# EAGLE design simple-loop-active5 (EAGLE 6.6.0)

## Sheet 1 of 2
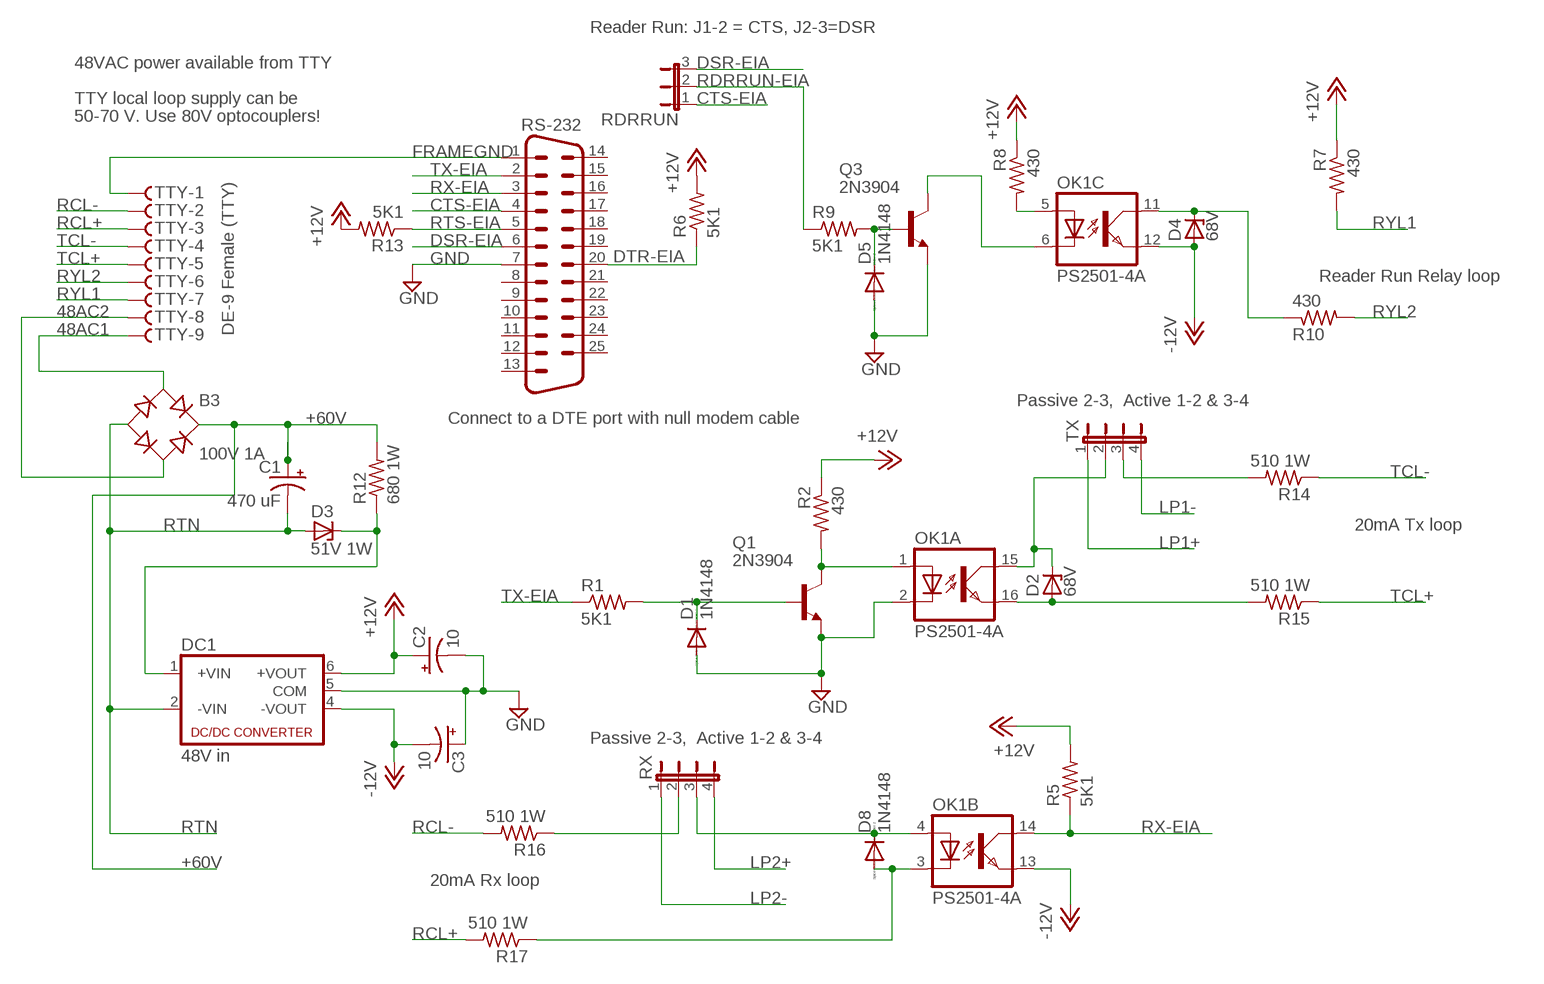
[diagram p0: schematic, sheet 1]

### Parts
B3  100V 1A  RB1A  [RB1A]
C1  470 uF  CPOL-USE7.5-18  [E7,5-18]
C2  10  CPOL-USB45181A  [B45181A]
C3  10  CPOL-USB45181A  [B45181A]
D1  1N4148  1N4148DO35-10  [DO35-10]
D2  68V  ZENER-DIODEDO41Z10  [DO41Z10]
D3  51V 1W  ZENER-DIODEDO41Z10  [DO41Z10]
D4  68V  ZENER-DIODEDO41Z10  [DO41Z10]
D5  1N4148  1N4148DO35-10  [DO35-10]
D8  1N4148  1N4148DO35-10  [DO35-10]
DC1  48V in  NMA  [NMA]
OK1  PS2501-4A  ILQ1  [DIL16]
Q1  2N3904  [TO92]
Q3  2N3904  [TO92]
R1  5K1  R-US_0207/10  [0207/10]
R2  430  R-US_0207/10  [0207/10]
R5  5K1  R-US_0207/10  [0207/10]
R6  5K1  R-US_0207/10  [0207/10]
R7  430  R-US_0207/10  [0207/10]
R8  430  R-US_0207/10  [0207/10]
R9  5K1  R-US_0207/10  [0207/10]
R10  430  R-US_0207/10  [0207/10]
R12  680 1W  R-US_0817/7V  [P0817V]
R13  5K1  R-US_0207/10  [0207/10]
R14  510 1W  R-US_0817/7V  [P0817V]
R15  510 1W  R-US_0817/7V  [P0817V]
R16  510 1W  R-US_0817/7V  [P0817V]
R17  510 1W  R-US_0817/7V  [P0817V]
RDRRUN  JP2E  [JP2]
RS-232  M25H  [M25H]
RX  JP4E  [JP4]
TTY  F09HS  [F09H]
TX  JP4E  [JP4]

### Nets
48AC1: B3.AC1 TTY.9
48AC2: B3.AC2 TTY.8
+12V: C2.+ DC1.6(+VOUT) R2.1 R5.2 R6.2 R7.1 R8.1 R13.2
+48VDC: D3.C DC1.1(+VIN) R12.1
+60V: B3.+ C1.+ R12.2 ; also sheet 2
-12V: C3.- D4.A DC1.4(-VOUT) OK1.12(C:EMIT) OK1.13(B:EMIT)
CTS-EIA: RDRRUN.1 RS-232.4
DSR-EIA: RDRRUN.3 RS-232.6
DTR-EIA: R6.1 RS-232.20
FRAMEGND: RS-232.1 TTY.1
GND [GND]: C2.- C3.+ D1.A D5.A DC1.5(COM) OK1.2(A:C) Q1.3(E) Q3.3(E) RS-232.7
LP1+: TX.1 ; also sheet 2
LP1-: TX.4 ; also sheet 2
LP2+: RX.4 ; also sheet 2
LP2-: RX.1 ; also sheet 2
N$1: D8.C OK1.4(B:A) RX.3
N$2: R16.1 RX.2
N$3: D8.A OK1.3(B:C) R17.1
N$4: D2.A OK1.16(A:EMIT) R15.2
N$5: OK1.5(C:A) R8.2
N$6: D2.C OK1.15(A:COL) TX.2
N$7: D1.C Q1.2(B) R1.2
N$8: D4.C OK1.11(C:COL) R10.1
N$9: OK1.1(A:A) Q1.1(C) R2.2
N$15: OK1.6(C:C) Q3.1(C)
N$16: D5.C Q3.2(B) R9.2
N$19: R14.2 TX.3
RCL+: R17.2 TTY.3
RCL-: R16.2 TTY.2
RDRRUN-EIA: R9.1 RDRRUN.2
RTN: B3.- C1.- D3.A DC1.2(-VIN) ; also sheet 2
RTS-EIA: R13.1 RS-232.5
RX-EIA: OK1.14(B:COL) R5.1 RS-232.3
RYL1: R7.2 TTY.7
RYL2: R10.2 TTY.6
TCL+: R15.1 TTY.5
TCL-: R14.1 TTY.4
TX-EIA: R1.1 RS-232.2
Unconnected: RS-232.8 RS-232.9 RS-232.10 RS-232.11 RS-232.12 RS-232.13 RS-232.14 RS-232.15 RS-232.16 RS-232.17 RS-232.18 RS-232.19 RS-232.21 RS-232.22 RS-232.23 RS-232.24 RS-232.25

### Notes on the sheet
- Reader Run: J1-2 = CTS, J2-3=DSR
- 48VAC power available from TTY
- TTY local loop supply can be
- 50-70 V. Use 80V optocouplers!
- Reader Run Relay loop
- DE-9 Female (TTY)
- Passive 2-3,  Active 1-2 & 3-4
- Connect to a DTE port with null modem cable
- 20mA Tx loop
- Passive 2-3,  Active 1-2 & 3-4
- 20mA Rx loop

## Sheet 2 of 2
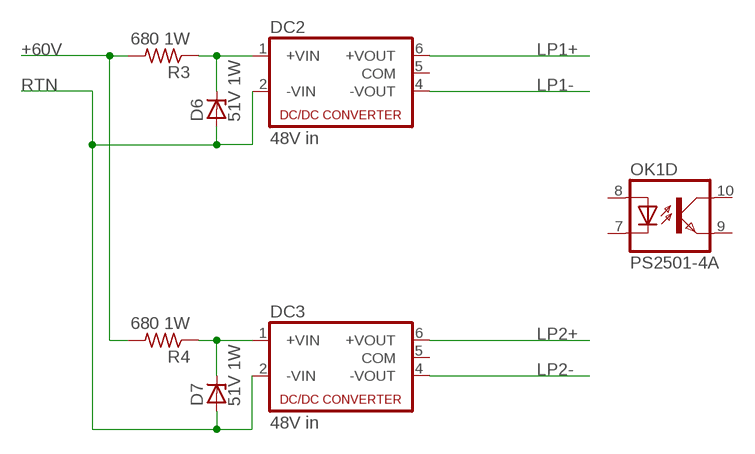
[diagram p1: schematic, sheet 2]

### Parts
D6  51V 1W  ZENER-DIODEDO41Z10  [DO41Z10]
D7  51V 1W  ZENER-DIODEDO41Z10  [DO41Z10]
DC2  48V in  NMA  [NMA]
DC3  48V in  NMA  [NMA]
R3  680 1W  R-US_0817/7V  [P0817V]
R4  680 1W  R-US_0817/7V  [P0817V]

### Nets
+48VDC1: D6.C DC2.1(+VIN) R3.1
+48VDC2: D7.C DC3.1(+VIN) R4.1
+60V: R3.2 R4.2 ; also sheet 1
LP1+: DC2.6(+VOUT) ; also sheet 1
LP1-: DC2.4(-VOUT) ; also sheet 1
LP2+: DC3.6(+VOUT) ; also sheet 1
LP2-: DC3.4(-VOUT) ; also sheet 1
RTN: D6.A D7.A DC2.2(-VIN) DC3.2(-VIN) ; also sheet 1
Unconnected: DC2.5(COM) DC3.5(COM) OK1.7(D:C) OK1.8(D:A) OK1.9(D:EMIT) OK1.10(D:COL)

## Library data of the parts
B3 = rectifier:RB1A: RECTIFIER 1 A
C1-C3 = rcl:CPOL-US: POLARIZED CAPACITOR, American symbol
D1 D5 D8 = diode:1N4148: DIODE high speed (Philips)
D2-D4 D6 D7 = diode:ZENER-DIODE: Z-Diode
DC1-DC3 = dc-dc-converter:NMA: DC-DC CONVERTER; MF: C & D TECHNOLOGIES, INC; MPN: NMA0515SC; OC_FARNELL: 1021434; OC_NEWARK: 61K3064
OK1 = optocoupler:ILQ1: SIEMENS OPTO COUPLER; MF: VISHAY/TELEFUNKEN; MPN: ILQ1; OC_FARNELL: 1469501; OC_NEWARK: 88K1954
Q1 Q3 = transistor-npn:2N3904: NPN Transistor
R1-R10 R12-R17 = rcl:R-US_: RESISTOR, American symbol
RDRRUN = jumper:JP2E: JUMPER
RS-232 = con-subd:M25: SUB-D; OC_FARNELL: unknown; OC_NEWARK: unknown
RX TX = jumper:JP4E: JUMPER
TTY = con-subd:F09?S: SUB-D; OC_FARNELL: unknown; OC_NEWARK: unknown

## Net classes
1 GND: width 0.508 mm

## Board
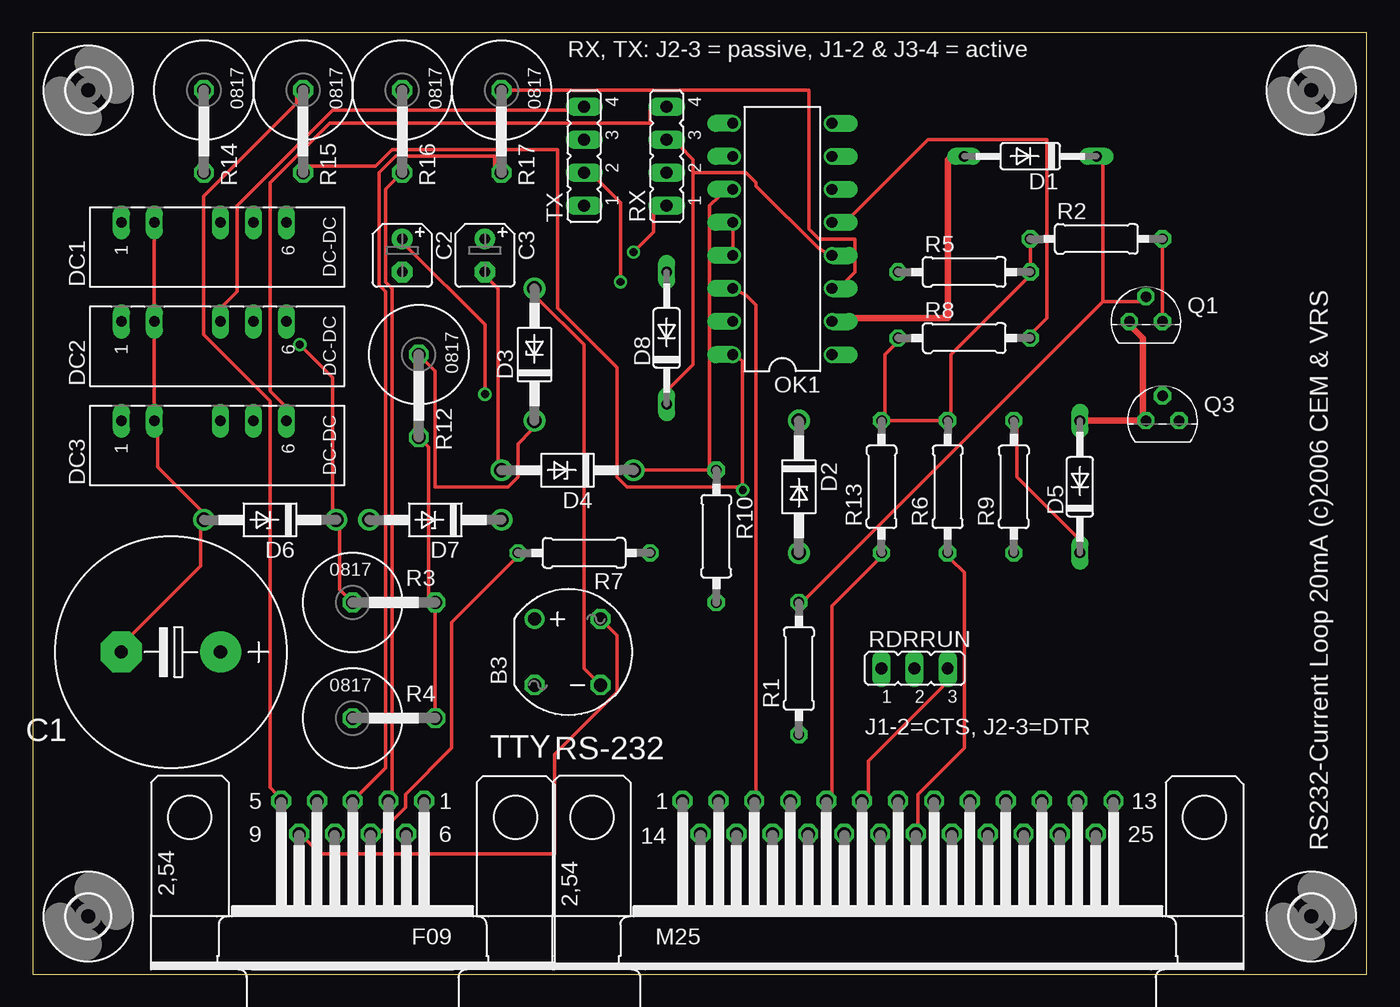
[diagram p2: board, top side]
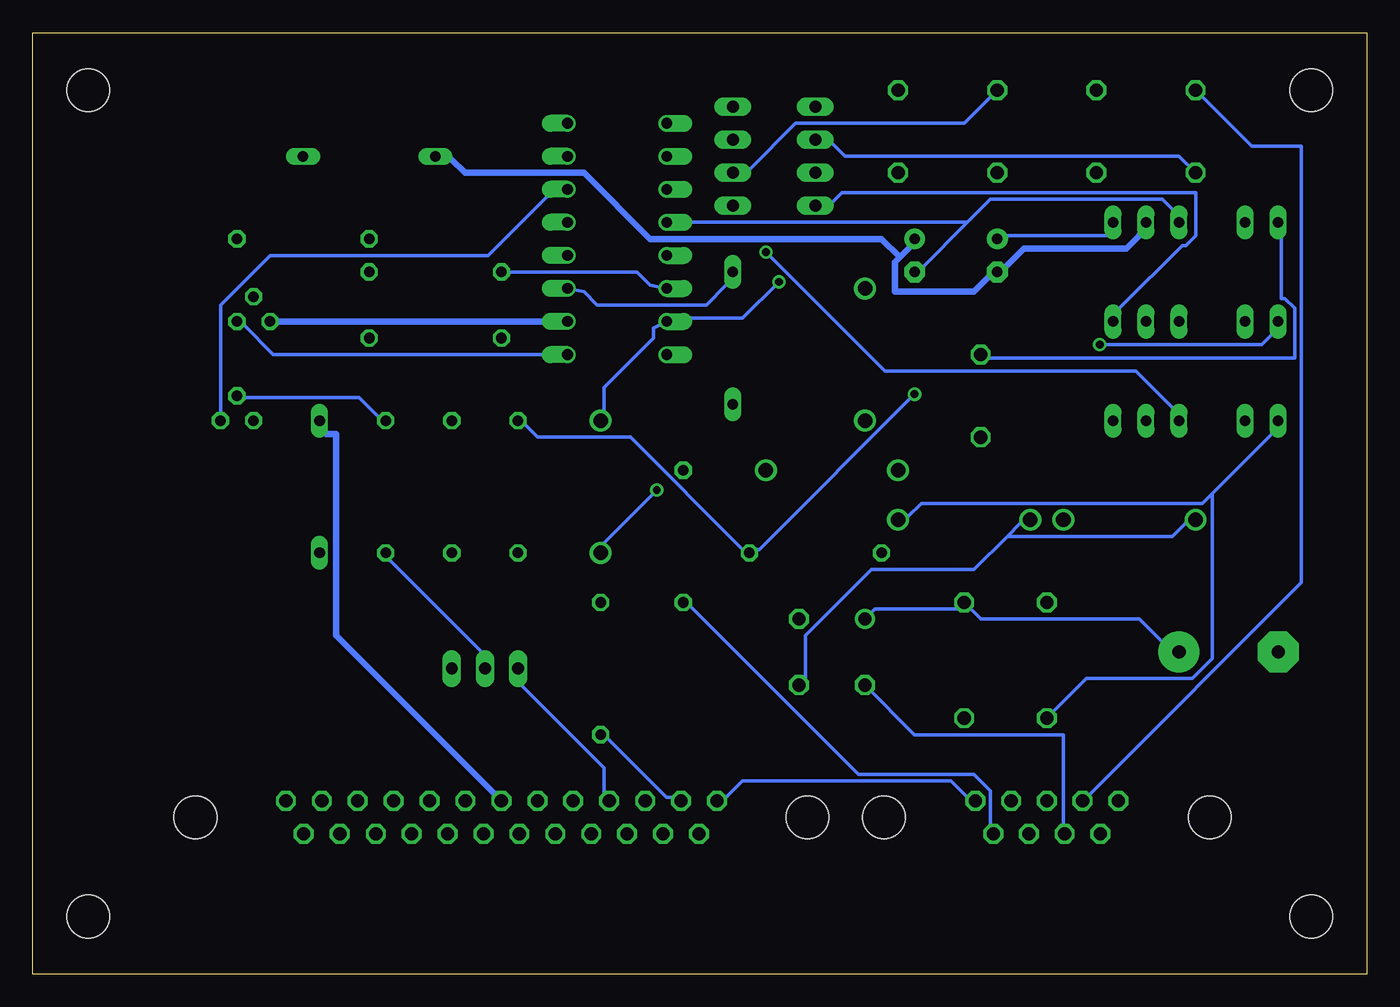
[diagram p3: board, bottom side, seen from below]

Size 102.54 x 72.37 mm. Coordinates in mm from the lower left corner, seen from the top.
Outline: 102.54,0 102.54,72.37 0,72.37 0,0 102.54,0
Copper layers (1*16): Top 0.035mm / dielectric 1.5mm / Bottom 0.035mm
Design rules "10mils *": minimum track width 10mil, minimum drill 24mil, track to track 10mil, track to pad 10mil, pad to pad 10mil, via to via 10mil, smd to smd 10mil, copper to edge 40mil, drill to drill 10mil, minimum pad ring 10mil, minimum via ring 8mil, stop-mask expansion 0mil, vias tented up to drill 0mil, thermal gap 10mil

### Footprints (pad centres in the part's own frame; a part is rotated, then mirrored left to right if it is on the bottom)
RB1A = drill 1.016: + -2.54,2.54 | drill 1.016 octagon: - 2.54,-2.54; AC1 2.54,2.54; AC2 -2.54,-2.54
E7,5-18 = drill 1.016 pad 3.15: + -3.81,0 | drill 1.016 pad 3.15 octagon: - 3.81,0
B45181A = drill 0.813 pad 1.6: + -1.27,0 | drill 0.813 pad 1.6 octagon: - 1.27,0
DO35-10 = drill 0.813 long: A 5.08,0; C -5.08,0
DO41Z10 = drill 1.118: A 5.08,0; C -5.08,0
NMA = drill 0.813 long: 1 0,6.35; 2 0,3.81; 4 0,-1.27; 5 0,-3.81; 6 0,-6.35
DIL16 = drill 0.813 offset: 1 -8.89,-3.81; 2 -6.35,-3.81; 3 -3.81,-3.81; 4 -1.27,-3.81; 5 1.27,-3.81; 6 3.81,-3.81; 7 6.35,-3.81; 8 8.89,-3.81; 9 8.89,3.81; 10 6.35,3.81; 11 3.81,3.81; 12 1.27,3.81; 13 -1.27,3.81; 14 -3.81,3.81; 15 -6.35,3.81; 16 -8.89,3.81
TO92 = drill 0.813 octagon: 1 1.27,0; 2 0,1.905; 3 -1.27,0
0207/10 = drill 0.813 octagon: 1 -5.08,0; 2 5.08,0
P0817V = drill 1.016 octagon: 1 -5.08,0; 2 1.27,0
JP2 = drill 0.914 long: 1 -2.54,0; 2 0,0; 3 2.54,0
M25H = drill 1.016 octagon: 1 -16.561,1.27; 2 -13.792,1.27; 3 -11.049,1.27; 4 -8.28,1.27; 5 -5.512,1.27; 6 -2.769,1.27; 7 0,1.27; 8 2.769,1.27; 9 5.512,1.27; 10 8.28,1.27; 11 11.049,1.27; 12 13.792,1.27; 13 16.561,1.27; 14 -15.189,-1.27; 15 -12.421,-1.27; 16 -9.652,-1.27; 17 -6.909,-1.27; 18 -4.14,-1.27; 19 -1.372,-1.27; 20 1.372,-1.27; 21 4.14,-1.27; 22 6.909,-1.27; 23 9.652,-1.27; 24 12.421,-1.27; 25 15.189,-1.27 | hole 3.302: 23.52,0; -23.52,0
JP4 = drill 0.914 long: 1 -3.81,0; 2 -1.27,0; 3 1.27,0; 4 3.81,0
F09H = drill 1.016 octagon: 1 -5.486,-1.27; 2 -2.743,-1.27; 3 0,-1.27; 4 2.743,-1.27; 5 5.486,-1.27; 6 -4.115,1.27; 7 -1.372,1.27; 8 1.372,1.27; 9 4.115,1.27 | hole 3.302: -12.522,0; 12.522,0
3,3 = hole 3.3: 0,0

### Placement (x,y rotation side)
B3  41.11,24.76 0 top
C1  10.63,24.76 180 top
C2  28.41,55.24 270 top
C3  34.76,55.24 270 top
D1  76.67,62.86 180 top
D2  58.89,37.46 270 top
D3  38.57,47.62 90 top
D4  41.11,38.73 180 top
D5  80.48,37.46 90 top
D6  18.25,34.92 180 top
D7  30.95,34.92 180 top
D8  48.73,48.89 90 top
DC1  13.17,57.78 90 top
DC2  13.17,50.16 90 top
DC3  13.17,42.54 90 top
OK1  57.62,56.51 90 top
Q1  85.56,50.16 0 top
Q3  86.83,42.54 0 top
R1  58.89,23.49 90 top
R2  81.75,56.51 0 top
R3  29.68,28.57 0 top
R4  29.68,19.68 0 top
R5  71.59,53.97 0 top
R6  70.32,37.46 90 top
R7  42.38,32.38 180 top
R8  71.59,48.89 0 top
R9  75.4,37.46 90 top
R10  52.54,33.65 270 top
R12  29.68,42.54 270 top
R13  65.24,37.46 90 top
R14  13.17,62.86 270 top
R15  20.79,62.86 270 top
R16  28.41,62.86 270 top
R17  36.03,62.86 270 top
RDRRUN  67.78,23.49 0 top
RS-232  66.51,12.06 0 top
RX  48.73,62.86 90 top
TTY  24.6,12.06 180 top
TX  42.38,62.86 90 top
U$1  [3,3]  4.28,67.94 0 top
U$2  [3,3]  4.28,4.44 0 top
U$3  [3,3]  98.26,67.94 0 top
U$4  [3,3]  98.26,4.44 0 top

### Tracks (layer width: path | path; a pad name or v marks a point on that pad's centre or on a via)
48AC1
  Top 0.254: TTY.9 21.04,10.28 22.06,9.27 40.09,9.27 40.09,16.89 44.92,21.71 44.92,26.03 B3.AC1
48AC2
  Bottom 0.254: TTY.8 23.33,11.3 23.33,18.41 34.76,18.41 B3.AC2
+12V  (via drill 0.61)
  Top 0.254: R2.1 R5.2 76.42,53.46 70.57,47.62 70.57,43.05 R6.2 R13.2 65.49,43.05 65.49,47.62 66.26,48.38 R8.1 | v34.76,44.57 34.76,49.91 28.66,56 C2.+
  Bottom 0.254: C2.+ 27.9,56.76 20.03,56.76 DC1.6 | R13.2 64.73,42.29 63.72,41.27 56.6,41.27 47.97,32.63 R7.1 46.95,32.63 46.7,32.63 v34.76,44.57
+48VDC
  Top 0.254: D3.C 38.32,41.78 37.3,40.76 37.3,38.22 36.54,37.46 30.95,37.46 30.95,46.35 R12.1
  Bottom 0.254: DC1.1 6.57,56.51 6.57,51.94 6.31,51.94 5.55,51.18 5.55,47.37 29.17,47.37 R12.1
+48VDC1  (via drill 0.61)
  Top 0.254: v20.54,48.38 23.08,45.84 23.08,35.68 D6.C 23.58,34.16 23.58,29.59 R3.1
  Bottom 0.254: v20.54,48.38 8.09,48.38 7.33,49.14 DC2.1
+48VDC2
  Bottom 0.254: 11.9,36.95 12.66,36.19 34.25,36.19 35.27,35.17 D7.C | 11.9,36.95 7.33,41.52 DC3.1 | 11.9,36.95 11.9,24.25 13.42,22.73 21.55,22.73 R4.1
+60V
  Top 0.254: R4.2 R3.2 30.44,29.08 30.44,40.51 R12.2
  Bottom 0.254: B3.+ 37.81,28.06 31.46,28.06 R3.2 29.68,27.3 17.49,27.3 15.2,25.01 C1.+
-12V
  Top 0.254: OK1.12 OK1.13 | C3.- 35.01,53.46 35.78,52.7 35.78,39.49 D4.A
  Bottom 0.254: 30.7,57.78 34.25,54.22 C3.- | 30.7,57.78 28.92,59.56 15.71,59.56 14.95,58.8 DC1.4 | 30.7,57.78 OK1.12
CTS-EIA
  Bottom 0.254: RDRRUN.1 64.99,22.22 58.64,15.87 58.64,13.84 RS-232.4
DSR-EIA
  Top 0.254: RDRRUN.3 70.07,22.22 64.22,16.38 64.22,13.84 RS-232.6
DTR-EIA
  Top 0.254: R6.1 70.57,31.87 71.59,30.86 71.59,17.39 68.03,13.84 68.03,11.3 RS-232.20
FRAMEGND
  Bottom 0.254: TTY.1 30.7,13.58 31.97,14.85 47.97,14.85 49.24,13.58 RS-232.1
GND
  Top 0.508: D5.A Q3.3 85.31,43.05 85.31,48.89 84.54,49.65 Q1.3 | OK1.2 62.7,50.41 70.32,50.41 70.32,62.61 D1.A
  Bottom 0.508: RS-232.7 79.21,26.03 79.21,41.52 79.97,41.52 D5.A | DC1.5 17.49,56.76 18.5,55.75 26.38,55.75 27.9,54.22 C2.- 28.92,53.72 30.19,52.45 36.28,52.45 36.28,54.73 35.9,55.11 | 35.9,55.11 35.01,56 C3.+ | 35.9,55.11 37.3,56.51 55.08,56.51 60.16,61.59 69.3,61.59 70.32,62.61 D1.A | OK1.2 Q1.3
LP1+
  Bottom 0.254: DC2.6 19.01,51.18 14.19,56 13.93,56 13.17,56.76 13.17,60.07 40.35,60.07 41.11,59.3 TX.1
LP1-
  Top 0.254: DC2.4 14.69,51.43 15.71,52.45 15.71,59.05 23.08,66.42 41.11,66.42 TX.4
LP2+
  Top 0.254: DC3.6 19.27,43.81 18.25,44.83 18.25,60.83 22.82,65.4 47.46,65.4 47.46,66.42 RX.4
LP2-  (via drill 0.61)
  Top 0.254: v46.19,55.49 47.71,57.02 47.71,58.54 RX.1
  Bottom 0.254: v46.19,55.49 37.05,46.35 17.74,46.35 14.95,43.56 DC3.4
N$1
  Top 0.254: 50.76,61.59 50.76,62.61 49.75,63.62 RX.3 | 50.76,61.59 50.76,46.86 48.98,45.08 D8.C | 50.76,61.59 54.83,61.59 55.59,60.83 55.59,60.57 60.41,55.75 OK1.4
N$2
  Bottom 0.254: RX.2 47.46,61.84 43.9,65.4 30.95,65.4 R16.1
N$3
  Top 0.254: R17.1 59.65,67.94 59.65,57.27 60.41,56.51 63.21,56.51 63.21,53.97 62.45,53.21 OK1.3
  Bottom 0.254: D8.A 49.24,52.95 50.76,51.43 59.14,51.43 60.16,52.45 OK1.3
N$4  (via drill 0.61)
  Top 0.254: OK1.16 54.57,47.11 v54.57,37.21 54.32,37.46 45.68,37.46 44.92,38.22 44.92,46.6 40.35,51.18 40.35,63.37 27.65,63.37 26.38,62.1 21.3,62.1 R15.2
  Bottom 0.254: v54.57,37.21 58.64,33.14 D2.A
N$5
  Top 0.254: OK1.5 62.7,58.03 68.8,64.13 77.94,64.13 77.94,50.41 76.92,49.4 R8.2
N$6  (via drill 0.61)
  Top 0.254: v45.17,53.21 45.17,59.3 43.4,61.08 TX.2
  Bottom 0.254: D2.C 58.64,43.3 58.64,45.08 54.83,48.89 54.83,49.65 OK1.15 52.54,50.41 47.97,50.41 v45.17,53.21
N$7
  Top 0.254: 82.26,51.68 59.4,28.82 R1.2 | 82.26,51.68 85.05,51.68 Q1.2 | 82.26,51.68 82.26,62.35 D1.C
N$8
  Top 0.254: D4.C R10.1 52.03,38.98 52.03,59.05 52.79,59.81 OK1.11
N$9
  Top 0.254: Q1.1 R2.2
  Bottom 0.254: OK1.1 84.04,47.62 86.32,49.91 Q1.1
N$15
  Bottom 0.254: OK1.6 62.7,60.07 67.53,55.24 84.29,55.24 88.1,51.43 Q3.1
N$16
  Top 0.254: D5.C 80.23,33.65 75.65,38.22 75.65,42.03 R9.2
  Bottom 0.254: Q3.2 86.32,44.32 77.43,44.32 75.91,42.79 R9.2
N$19
  Bottom 0.254: TX.3 41.11,63.88 40.09,62.86 14.44,62.86 R14.2
RCL+
  Top 0.254: TTY.3 27.14,15.87 27.14,52.45 26.63,52.95 26.63,61.59 27.9,62.86 35.52,62.86 35.52,62.1 R17.2
RCL-
  Top 0.254: TTY.2 27.65,13.84 27.65,52.7 27.14,53.21 27.14,60.32 R16.2
RDRRUN-EIA
  Bottom 0.254: R9.1 75.15,31.87 68.03,24.76 RDRRUN.2
RTN
  Top 0.254: DC1.2 DC2.2 DC3.2 9.61,41.27 9.61,38.98 12.92,35.68 D6.A 12.92,34.16 12.92,31.36 7.07,25.52 C1.- | D3.A 38.82,51.94 42.38,48.38 42.38,23.49 B3.-
  Bottom 0.254: 27.65,33.65 26.63,34.67 D7.A | 27.65,33.65 30.19,31.11 38.06,31.11 43.14,26.03 43.14,22.73 B3.- | 27.65,33.65 14.95,33.65 13.93,34.67 D6.A
RTS-EIA
  Top 0.254: R13.1 64.99,31.87 61.43,28.32 61.43,13.84 RS-232.5
RX-EIA
  Top 0.254: RS-232.3 55.59,13.84 55.59,51.43 54.83,52.19 OK1.14
  Bottom 0.254: OK1.14 55.08,52.95 56.1,53.97 R5.1
RYL1
  Top 0.254: R7.2 37.05,31.87 32.22,27.05 32.22,17.39 28.66,13.84 28.66,12.82 26.63,10.79 TTY.7
RYL2
  Bottom 0.254: R10.2 52.03,28.32 39.08,15.36 30.19,15.36 28.92,14.09 28.92,11.3 TTY.6
TCL+
  Top 0.254: TTY.5 18.76,13.84 18.25,14.35 18.25,44.06 13.17,49.14 13.17,59.81 20.28,66.92 20.28,67.43 R15.1
TCL-
  Bottom 0.254: TTY.4 21.3,13.84 5.04,30.09 5.04,63.62 8.85,63.62 R14.1
TX-EIA
  Bottom 0.254: R1.1 58.38,18.16 53.81,13.58 53.3,13.58 RS-232.2

### Text on the board
tNames: RX, TX: J2-3 = passive, J1-2 & J3-4 = active | J1-2=CTS, J2-3=DTR | RS232-Current Loop 20mA (c)2006 CEM & VRS